# EAGLE design Palplant (EAGLE 7.5.0)
DBDIGIKEY: C:\eagle-7.5.0\digikeydb.txt
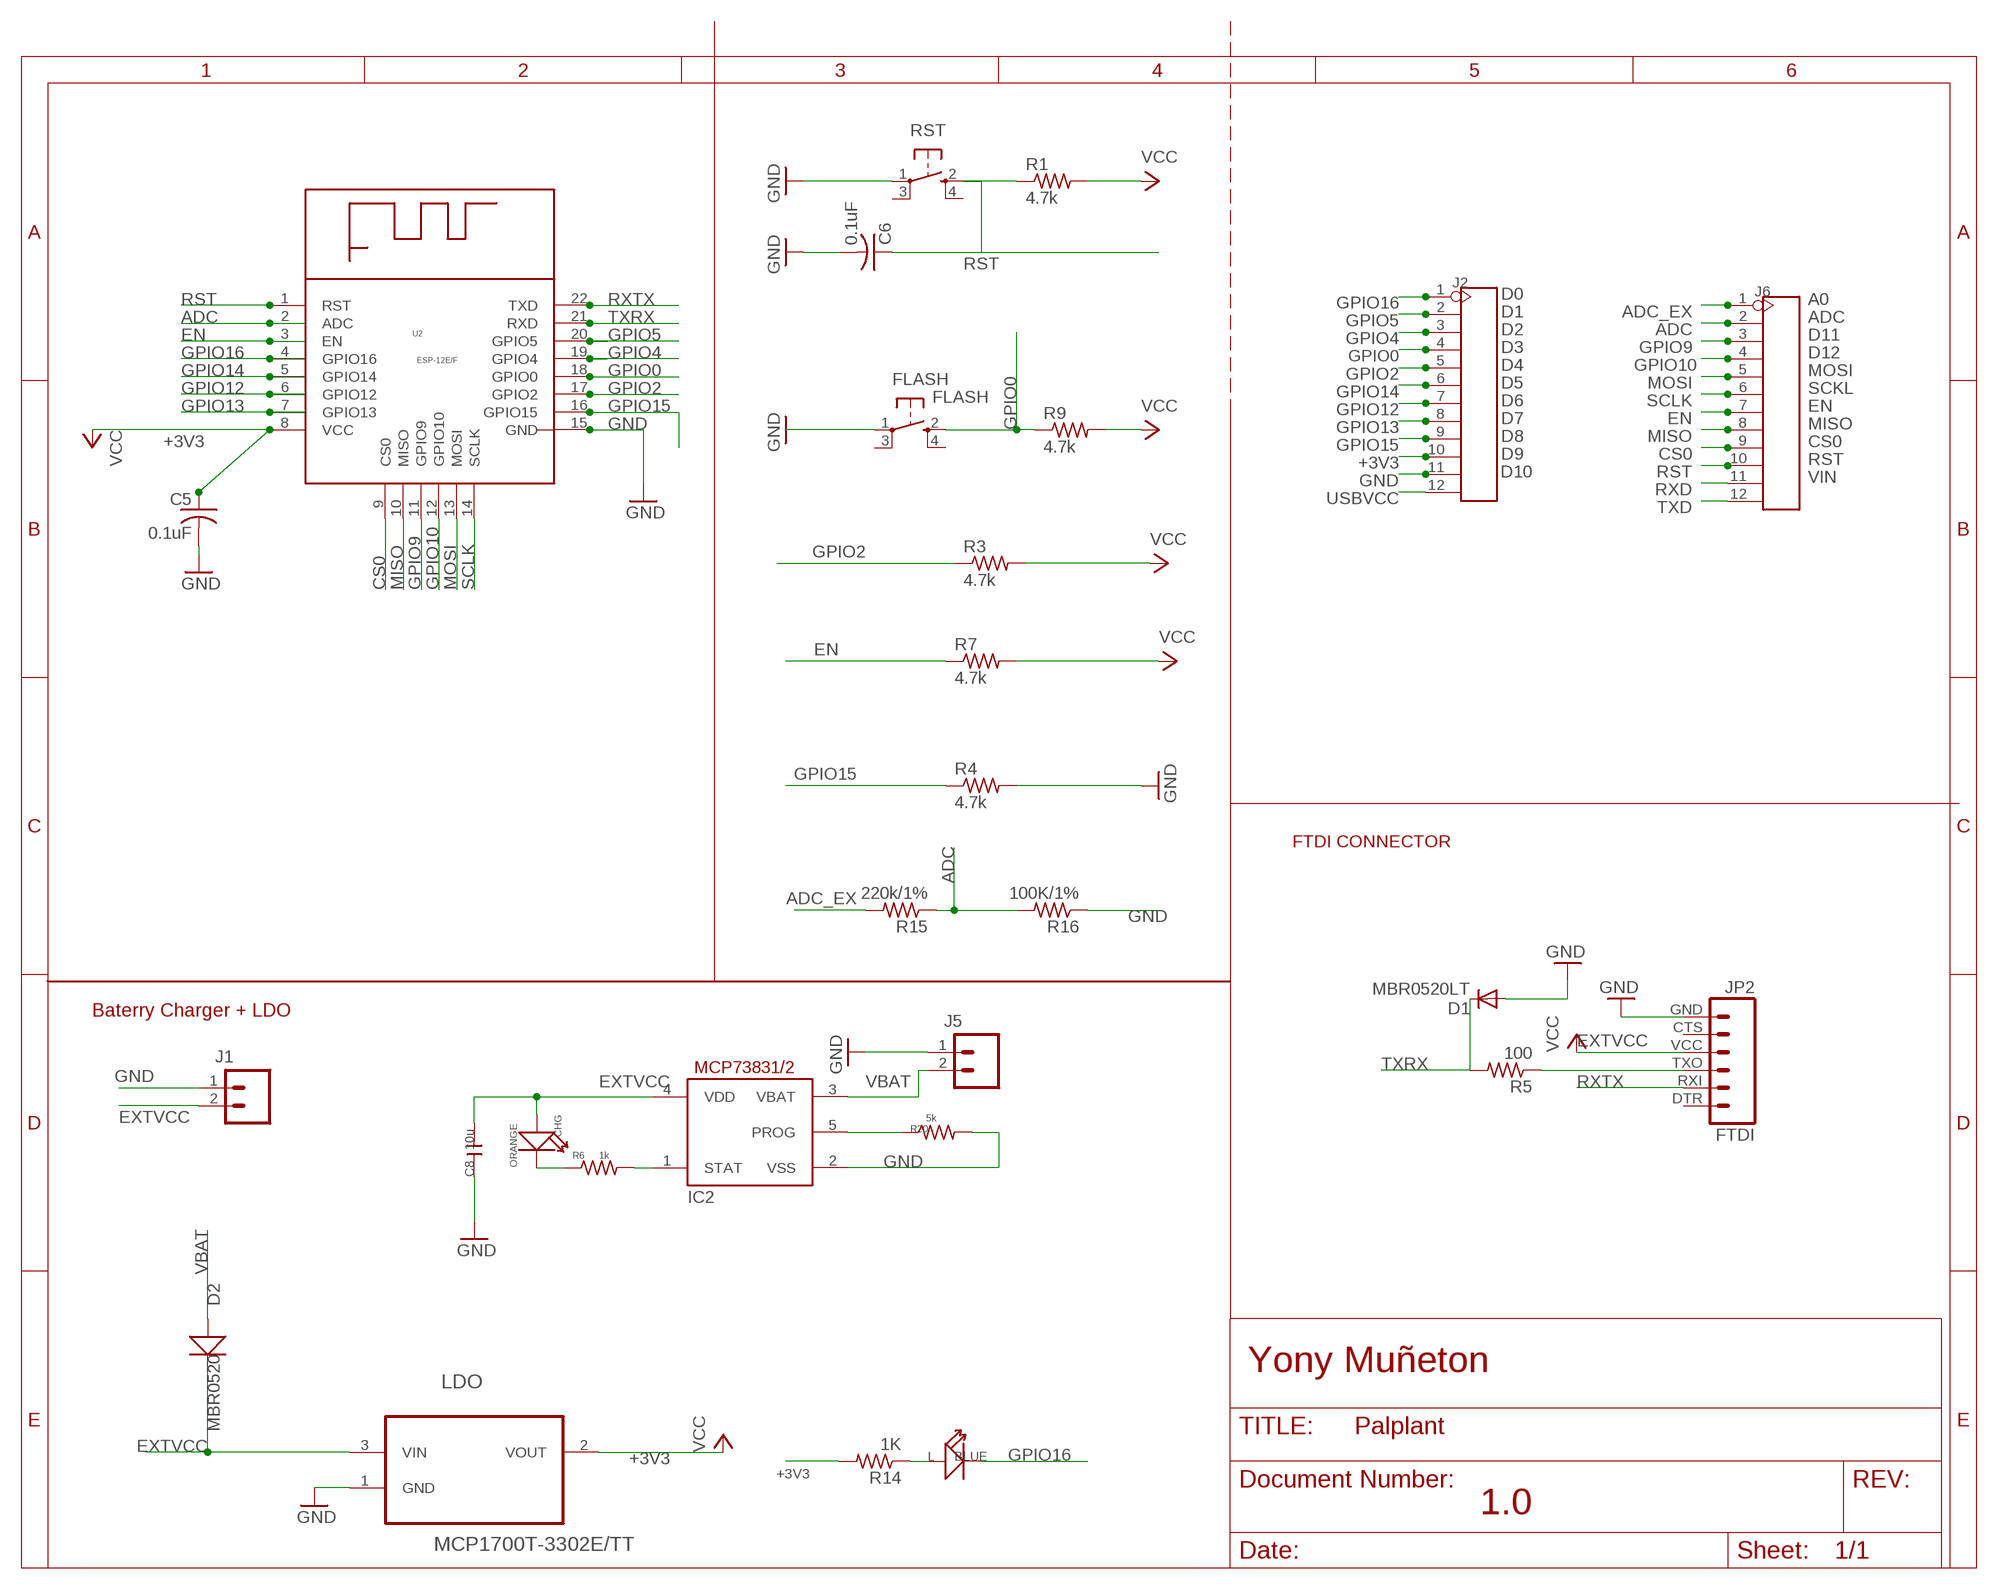
[diagram p0: schematic, sheet 1]

## Parts
C5  0.1uF  C-USC0603  [C0603]
C6  0.1uF  C-USC0603  [C0603]
C8  10u  C-0603  [C0603]
CHG  ORANGE  007-LED0603  [D0603]
D1  MBR0520LT  [SOD123]
D2  MBR0520  D'1206'  [SOD123]
FLASH  FLASH  SPST_TACT-KMR2  [KMR2]
IC2  MCP73831/OT  [SOT23-5L]
J1  M02-JST-2MM-SMT  [JST-2-SMD]
J2  HEADER-12P-2.54  [12P-2.54]
J5  M02-JST-2MM-SMT  [JST-2-SMD]
J6  HEADER-12P-2.54  [12P-2.54]
JP2  FTDI  FTDI_BASICPTH  [FTDI_BASIC]
L  BLUE  LED'0603'  [LED-0603]
LDO  MCP1700T-3302E/TT  [SOT95P237X112-3N]
R1  4.7k  R-US_R0603  [R0603]
R3  4.7k  R-US_R0603  [R0603]
R4  4.7k  R-US_R0603  [R0603]
R5  100  R-US_R0603  [R0603]
R6  1k  R-US_R0603  [R0603]
R7  4.7k  R-US_R0603  [R0603]
R9  4.7k  R-US_R0603  [R0603]
R14  1K  R-US_R0603  [R0603]
R15  220k/1%  R-US_R0603  [R0603]
R16  100K/1%  R-US_R0603  [R0603]
R20  5k  R-US_R0603  [R0603]
RST  SPST_TACT-KMR2  [KMR2]
U2  ESP-12E/F  [ESP-12E/F]

## Nets
+3V3: C5.1 J2.10 LDO.2(VOUT) R1.2 R3.2 R7.2 R9.2 R14.2 U2.8(VCC) ; supply symbol labelled VCC
ADC: J6.2 R15.1 R16.2 U2.2(ADC)
ADC_EX: J6.1 R15.2
CS0: J6.9 U2.9(CS0)
EN: J6.7 R7.1 U2.3(EN)
EXTVCC: C8.2 CHG.+ D2.- IC2.4(VDD) J1.2 JP2.VCC LDO.3(VIN) ; supply symbol labelled VCC
GND: C5.2 C6.2 C8.1 D1.A FLASH.1(P) IC2.2(VSS) J1.1 J2.11 J5.1 JP2.GND LDO.1(GND) R4.2 R16.1 R20.2 RST.1(P) U2.15(GND)
GPIO0: FLASH.2(S) J2.4 R9.1 U2.18(GPIO0)
GPIO2: J2.5 R3.1 U2.17(GPIO2)
GPIO4: J2.3 U2.19(GPIO4)
GPIO5: J2.2 U2.20(GPIO5)
GPIO9: J6.3 U2.11(GPIO9)
GPIO10: J6.4 U2.12(GPIO10)
GPIO12: J2.7 U2.6(GPIO12)
GPIO13: J2.8 U2.7(GPIO13)
GPIO14: J2.6 U2.5(GPIO14)
GPIO15: J2.9 R4.1 U2.16(GPIO15)
GPIO16: J2.1 L.- U2.4(GPIO16)
MISO: J6.8 U2.10(MISO)
MOSI: J6.5 U2.13(MOSI)
N$2: L.+ R14.1
N$5: CHG.- R6.1
N$6: JP2.TXO R5.1
N$20: IC2.1(STAT) R6.2
N$31: IC2.5(PROG) R20.1
RST: C6.1 J6.10 R1.1 RST.2(S) U2.1(RST)
RXD: J6.11
RXTX: JP2.RXI U2.22(TXD)
SCLK: J6.6 U2.14(SCLK)
TXD: J6.12
TXRX: D1.C R5.2 U2.21(RXD)
USBVCC: J2.12
VBAT: D2.+ IC2.3(VBAT) J5.2
Unconnected: FLASH.3(P1) FLASH.4(S1) JP2.CTS JP2.DTR RST.3(P1) RST.4(S1)

## Notes on the sheet
- D0
- D1 | A0
- D2 | ADC
- D3 | D11
- D4 | D12
- D5 | MOSI
- D6 | SCKL
- D7 | EN
- D8 | MISO
- D9 | CS0
- D10 | RST
- VIN
- FTDI CONNECTOR
- Baterry Charger + LDO
- Yony Muñeton
- 1.0

## Library data of the parts
C5 C6 = rcl:C-US: CAPACITOR, American symbol; MPN: 0805B104M500CT; OC_NEWARK: 78Y5293
C8 = Discrete:C*: Ceramic Capacitors
CHG = Discrete:007-LED*
D1 = diode:MBR0520LT: SCHOTTKY BARRIER RECTIFIER Source: http://onsemi.com .. MBR0520LT1-D.pdf; MF: ON SEMICONDUCTOR; MPN: 1N4004RLG; OC_NEWARK: 84K8827
D2 = Discrete:D*
FLASH RST = adafruit:SPST_TACT: SMT 6mm switch, EVQQ2 series http://www.ladyada.net/library/eagle; MPN: KMR221G LFS; OC_NEWARK: 01M8082
IC2 = adafruit:MCP73831: MCP73831/2 Miniature Single-Cell, Fully Integrated Li-Ion, Li-Polymer Charge Management Controllers. Nice and small simple lipoly charge controller, with adjustable current and status output (LED) http://www.ladyada.net/library/pcb/eaglelibrary.html
J1 J5 = SparkFun:M02: Header 2 Standard 2-pin 0.1" header. Use with straight break away headers (SKU : PRT-00116), right angle break away headers (PRT-00553), swiss pins (PRT-00743), machine pins (PRT-00117), and female headers (PRT-00115). Molex polarized connector foot print use with SKU : PRT-08233 with associated crimp pins and housings.
J2 J6 = Connector:HEADER-12P
JP2 = SparkFun:FTDI_BASIC: FTDI Basic: 3.3V and 5V; MPN: 2214S-06SG-85; OC_NEWARK: 08N6805
L = Discrete:LED*
LDO = MCP1700:MCP1700T-3302E/TT: Low Quiescent Current LDO; MPN: MCP1700T-3302E/TT; OC_FARNELL: 1296592; OC_NEWARK: 88H9817; PACKAGE: SOT23-3; SUPPLIER: Microchip
R1 R3 R4 R7 R9 = rcl:R-US_: RESISTOR, American symbol; MPN: MC0805S8F4701T5E; OC_NEWARK: 79M6093
R5 = rcl:R-US_: RESISTOR, American symbol; MPN: ERJ-6ENF1002V; OC_NEWARK: 64R5370
R6 R14-R16 R20 = rcl:R-US_: RESISTOR, American symbol
U2 = Discrete:ESP-12E/F

## Board
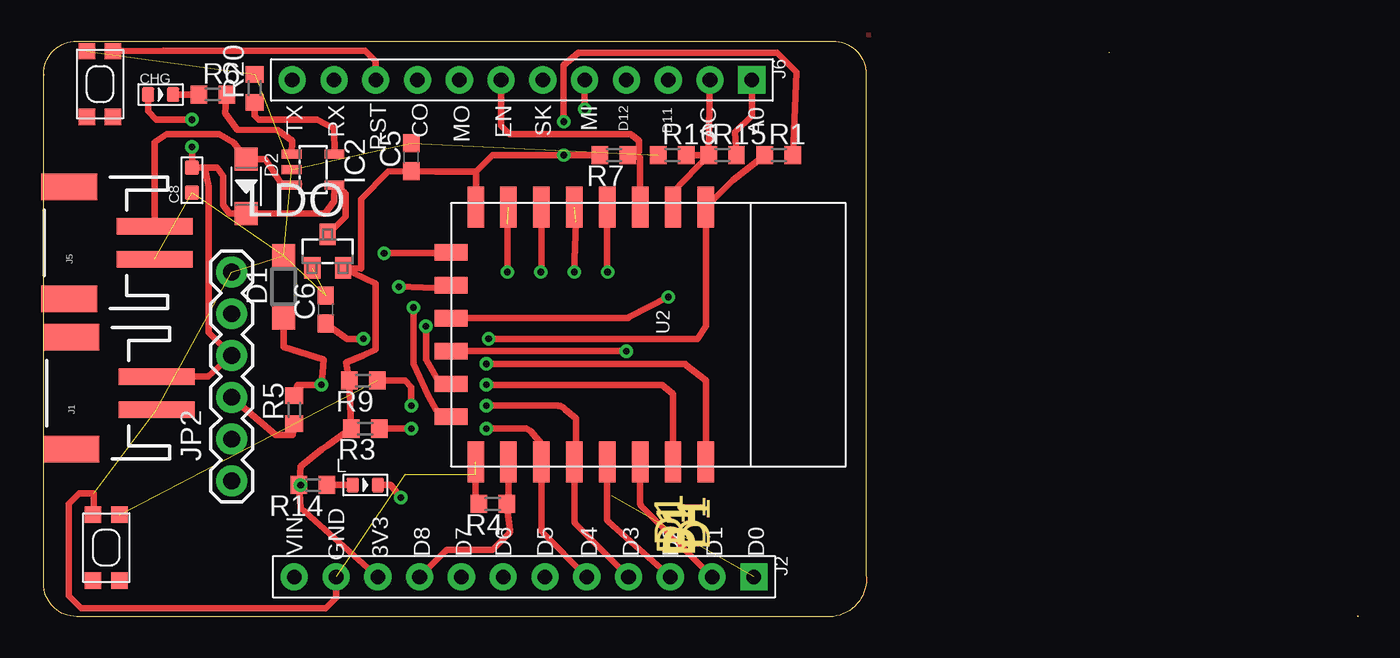
[diagram p1: board, top side]
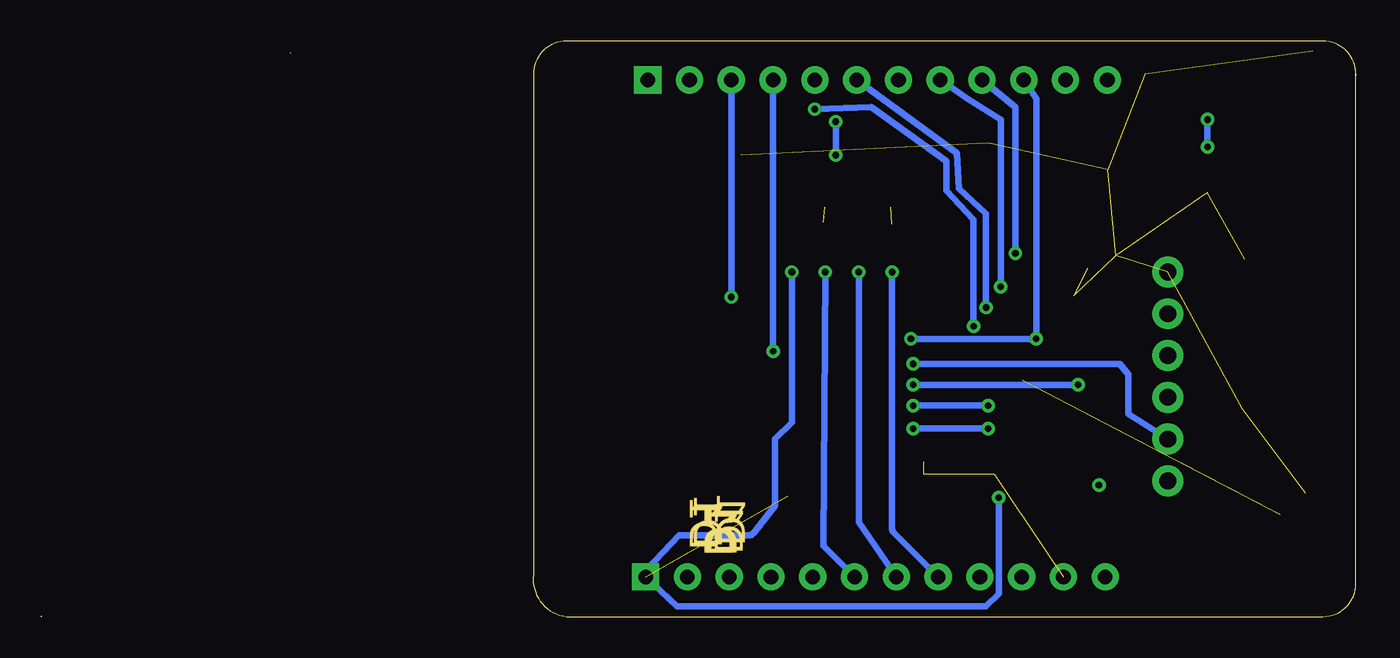
[diagram p2: board, bottom side, seen from below]

Size 79.93 x 35 mm. Coordinates in mm from the lower left corner, seen from the top.
Outline: 79.93,0 arc-90 79.88,0.05
Outline: 64.79,34.29 arc-2 64.75,34.29
Outline: 0,33 arc-90 0,32.94
Copper layers (1*16): Top 0.035mm / dielectric 1.5mm / Bottom 0.035mm
Design rules "default": minimum track width 10mil, minimum drill 24mil, track to track 8mil, track to pad 8mil, pad to pad 8mil, via to via 8mil, smd to smd 8mil, copper to edge 40mil, drill to drill 8mil, minimum pad ring 10mil, minimum via ring 8mil, stop-mask expansion 4mil, vias tented up to drill 0mil, thermal gap 10mil

### Footprints (pad centres in the part's own frame; a part is rotated, then mirrored left to right if it is on the bottom)
C0603 = smd 1.1 x 1: 1 -0.85,0; 2 0.85,0
C0603' = smd 0.889 x 0.889: 1 -0.762,0; 2 0.762,0
D0603 = smd 0.762 x 0.889: + -0.762,0; - 0.762,0
SOD123 = smd 1.4 x 1.4: A 1.9,0; C -1.9,0
SOD123' = smd 1.397 x 1.397: + -1.651,0; - 1.651,0
KMR2 = smd 1 x 1: 1 2,0.8; 2 2,-0.8; 3 -2,0.8; 4 -2,-0.8
SOT23-5L = smd 0.55 x 1.2: 1 -0.95,-1.3; 2 0,-1.3; 3 0.95,-1.3; 4 0.95,1.3; 5 -0.95,1.3
JST-2-SMD = smd 1 x 4.6: 1 -1,-3.7; 2 1,-3.7 | smd 1.6 x 3.4: NC1 -3.4,1.5; NC2 3.4,1.5
12P-2.54 = drill 0.889 pad 1.651 square: 1 0,13.97 | drill 0.889 pad 1.651: 2 0,11.43; 3 0,8.89; 4 0,6.35; 5 0,3.81; 6 0,1.27; 7 0,-1.27; 8 0,-3.81; 9 0,-6.35; 10 0,-8.89; 11 0,-11.43; 12 0,-13.97
FTDI_BASIC = drill 1.016 pad 1.88: CTS 10.16,0; DTR 0,0; GND 12.7,0; RXI 2.54,0; TXO 5.08,0; VCC 7.62,0
LED-0603 = smd 0.762 x 0.889: + -0.762,0; - 0.762,0
SOT95P237X112-3N = smd 0.991 x 1.321: 1 -0.94,-1.016; 2 0.94,-1.016; 3 0,1.016
R0603 = smd 1 x 1.1: 1 -0.85,0; 2 0.85,0
ESP-12E/F = smd 2.5 x 1: 1 0.25,15.5; 2 0.25,13.5; 3 0.25,11.5; 4 0.25,9.5; 5 0.25,7.5; 6 0.25,5.5; 7 0.25,3.5; 8 0.25,1.5; 15 15.75,1.5; 16 15.75,3.5; 17 15.75,5.5; 18 15.75,7.5; 19 15.75,9.5; 20 15.75,11.5; 21 15.75,13.5; 22 15.75,15.5 | smd 1 x 2: 9 3,0; 10 5,0; 11 7,0; 12 9,0; 13 11,0; 14 13,0

### Placement (x,y rotation side)
C5  22.35,27.94 90 top
C6  17.14,18.67 90 top
C8  10u  [C0603']  9.02,26.54 90 top
CHG  7.11,31.75 0 top
D1  14.61,20.07 90 top
D2  MBR0520  [SOD123']  12.32,26.16 270 top
FLASH  3.81,4.19 90 top
IC2  16.38,27.18 270 top
J1  3.17,13.59 90 top
J2  29.21,2.41 270 top
J5  3.05,22.73 90 top
J6  29.08,32.64 270 top
JP2  11.43,8.26 90 top
L  19.56,8 0 top
LDO  17.27,22.23 0 top
R1  44.7,28.07 0 top
R3  19.56,11.43 180 top
R4  27.3,6.86 180 top
R5  15.24,12.57 90 top
R6  10.29,31.75 0 top
R7  34.67,28.07 180 top
R9  19.43,14.35 180 top
R14  16.38,8 180 top
R15  41.27,28.07 0 top
R16  38.23,28.07 0 top
R20  12.83,32.13 90 top
RST  3.43,32.38 90 top
U2  24.77,25.15 270 top

### Tracks (layer width: path | path; a pad name or v marks a point on that pad's centre or on a via)
+3V3  (via drill 0.41)
  Top 0.406: J2.10 15.62,6.6 R14.2 15.62,9.14 16.89,10.16 17.27,10.41 R3.2 R9.2 18.38,15.46 19.43,15.88 20.19,16.26 20.19,20.24 LDO.2 19.3,21.18 19.3,25.39 20.95,27.05 C5.1 23.84,27.05 26.29,27.05 | R1.2 45.76,33.11 44.58,34.29 32.51,34.29 31.62,33.53 v31.62,30.1 | 26.29,27.05 27.3,28.07 v31.62,28.07 R7.2 | 26.29,27.05 26.29,24.92 U2.8
  Bottom 0.406: v31.62,30.1 v31.62,28.07
ADC
  Top 0.406: U2.2 38.27,25.82 R15.1 | R16.2 R15.1 | R15.1 J6.2
ADC_EX
  Top 0.406: R15.2 42.04,29.46 43.05,30.48 J6.1
CS0  (via drill 0.41)
  Top 0.406: v20.7,22.1 24.59,22.1 U2.9
  Bottom 0.406: J6.9 20.7,30.99 v20.7,22.1
EN
  Top 0.406: U2.3 36.27,27.91 R7.1 36.2,28.29 36.2,28.96 35.69,29.34 28.32,29.34 27.81,29.84 J6.7
EXTVCC  (via drill 0.41)
  Top 0.406: v9.02,28.57 C8.2 9.78,27.3 | v9.02,30.23 6.86,30.23 6.35,30.73 CHG.+ | J1.2 10.02,14.59 JP2.VCC 10.03,17.27 10.03,26.16 9.78,27.3 | 9.78,27.3 10.54,27.3 10.92,26.8 10.92,25.02 11.3,24.51 D2.- 17.11,24.51 17.65,25.27 IC2.4 18.29,25.78 18.35,25.72 18.35,24.32 LDO.3
  Bottom 0.406: v9.02,28.57 v9.02,30.23
GND  (15 unrouted)
  Top 0.406: R4.2 26.27,6.86 U2.15 | J2.11 17.78,1.14 17.14,0.51 2.29,0.51 1.52,1.27 1.52,6.86 2.16,7.49 3.05,7.49 3.05,6.23 FLASH.1
GPIO0  (via drill 0.41)  (1 unrouted)
  Top 0.406: J2.4 32.36,5.62 arc-45 32.27,5.84 U2.18 32.29,9.42 arc45 32.38,9.65 32.38,12.06 31.72,12.61 arc45 31.24,12.83 v26.92,12.83 | R9.1 21.97,14.35 22.35,13.97 v22.35,12.83
  Bottom 0.406: v26.92,12.83 v22.35,12.83
GPIO2  (via drill 0.41)
  Top 0.406: J2.5 30.27,5.17 U2.17 30.27,10.5 29.59,11.3 29.34,11.43 v26.92,11.43 | R3.1 v22.35,11.43
  Bottom 0.406: v22.35,11.43 v26.92,11.43
GPIO4
  Top 0.406: J2.3 34.36,5.77 arc-45 34.27,5.87 U2.19
GPIO5
  Top 0.406: J2.2 36.36,6.7 arc-45 36.27,6.92 U2.20
GPIO9  (via drill 0.41)
  Top 0.406: v37.97,19.43 35.64,18.24 arc-45 35.41,18.15 U2.11
  Bottom 0.406: J6.3 v37.97,19.43
GPIO10  (via drill 0.41)
  Top 0.406: U2.12 35.42,16.15 v35.43,16.13
  Bottom 0.406: v35.43,16.13 J6.4
GPIO12  (via drill 0.41)
  Top 0.406: v30.23,20.95 arc45 30.27,20.92 U2.6
  Bottom 0.406: J2.7 30.23,5.71 v30.23,20.95
GPIO13  (via drill 0.41)  (1 unrouted)
  Top 0.406: v28.19,20.95 28.19,23.88
  Bottom 0.406: J2.8 28.1,5.11 arc45 28.19,5.34 v28.19,20.95
GPIO14  (via drill 0.41)  (1 unrouted)
  Top 0.406: v32.26,20.95 32.38,24
  Bottom 0.406: J2.6 32.29,4.22 arc45 32.38,4.45 v32.26,20.95
GPIO15
  Top 0.406: J2.9 24.42,3.97 arc-45 24.64,4.06 27.3,4.06 28.27,5.02 arc45 28.36,5.25 R4.1 arc-45 28.27,7.08 U2.16
GPIO16  (via drill 0.41)  (1 unrouted)
  Top 0.406: v34.29,20.95 34.36,20.89 arc-45 34.27,21.11 U2.4 | L.- 21.08,8 v21.72,7.24
  Bottom 0.406: v34.29,20.95 34.29,11.81 35.31,10.79 35.31,6.73 36.61,5.05 arc45 36.96,4.95 41.15,4.95 43.09,2.89 arc-45 43.18,2.66 J2.1 41.27,0.64 22.48,0.64 21.72,1.4 v21.72,7.24
GRN
  pour Top (isolate 0.305): 0,0 0,34.86 arc-90 0,35.31 50.16,35.43 49.91,25.59 arc-90 49.59,25.27 43.05,25.27 43.05,9.14 arc-90 42.8,8.89 arc90 42.93,8.76 49.91,8.76 49.91,0
MISO  (via drill 0.41)
  Top 0.406: v21.59,20.07 24.56,19.94 U2.10
  Bottom 0.406: J6.8 23.62,31.5 21.59,30.23 v21.59,20.07
MOSI  (via drill 0.41)
  Top 0.406: J6.5 v32.89,30.86 | v23.24,17.65 23.24,15.62 24.13,14.1 24.72,14.1 U2.13
  Bottom 0.406: v32.89,30.86 29.46,30.99 24.89,27.69 24.89,25.91 23.24,24.13 v23.24,17.65
N$1  (via drill 0.41)
  other vias: 15.62,8
N$2
  Top 0.406: R14.1 L.+
N$5
  Top 0.406: CHG.- R6.1
N$6
  Top 0.406: JP2.TXO 13.08,11.94 14.1,11.05 15.15,11.05 R5.1
N$7  (via drill 0.41)
  other vias: 26.92,15.37
N$20
  Top 0.406: IC2.1 15.11,28.96 14.22,29.59 11.78,29.62 11.05,30.61 R6.2
N$31
  Top 0.406: R20.1 12.83,30.48 13.08,30.23 16.64,30.23 17.65,29.68 IC2.5
RST  (via drill 0.41)
  Top 0.406: v27.05,16.89 39.75,16.89 40.27,17.66 U2.1 41.91,26.54 R1.1 | v19.43,16.89 18.45,16.89 C6.1 | J6.10 20.19,33.78 19.56,34.42 7.31,34.42 RST.2
  Bottom 0.406: v27.05,16.89 v19.43,16.89 19.43,31.5 J6.10
RXTX
  Top 0.406: U2.22 arc-45 U2.22 40.26,14.35 39.08,15.27 arc45 38.98,15.37 26.8,15.37
  Bottom 0.406: JP2.RXI 13.84,12.32 13.84,14.73 14.35,15.37 26.8,15.37
SCLK  (via drill 0.41)
  Top 0.406: U2.14 24.56,12.15 23.88,12.57 23.37,13.46 22.48,15.37 v22.48,18.8
  Bottom 0.406: v22.48,18.8 22.48,24.51 24.13,26.04 24.26,28.19 J6.6
TXRX  (via drill 0.41)
  Top 0.406: U2.21 38.27,13.55 37.59,14.1 v26.92,14.1 | R5.2 15.46,14.1 v16.89,14.1 17.02,15.62 14.61,16.38 D1.C
  Bottom 0.406: v26.92,14.1 v16.89,14.1
VBAT
  Top 0.406: J5.2 6.75,28.85 7.49,29.34 10.67,29.34 11.56,28.83 D2.+ 13.46,27.81 14.48,26.29 15.53,26.29 IC2.3

### Text on the board
Dimension: D1 | D1 | D1 | D1 | D1 | D1 | D1
tNames: TX | RX | RST | CO | MO | EN | SK | MI | D12 | D11 | AC | A0 | GND | VIN | 3V3 | D8 | D7 | D6 | D5 | D4 | D3 | D2 | D1 | D0